# Altium schematic sheet Basic_Gates.SchDoc
size 111 x 66 mm
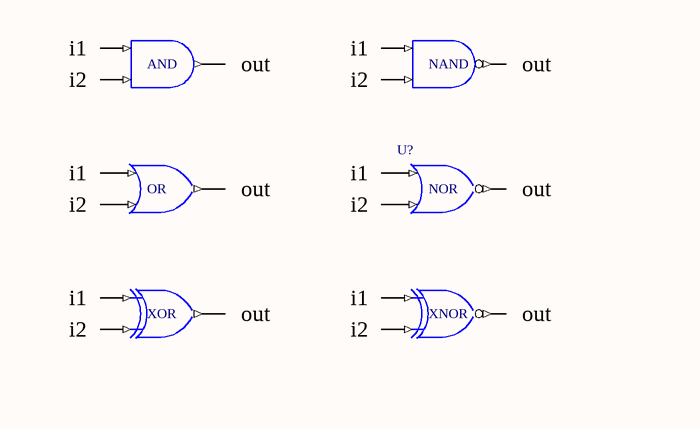
[diagram p0: Basic_Gates.SchDoc]

## Parts
(Parts that share a designator on the sheet are numbered #1, #2 ... from top to bottom, then left to right.)
U?#1  AND
U?#2  NAND
U?#3  OR
U?#4  NOR
U?#5  XOR
U?#6  XNOR

## Nets
GND: U?#5.7(GND)
VDD: U?#5.14(VDD)

Not connected (* = marked no-connect by the designer): U?#1 A B Y; U?#2 A B Y; U?#3 A B Y; U?#4 A B Y; U?#5 1(A) 2(B) 3(Y); U?#6 1(A) 2(B) 3(Y)

## Notes on the sheet
- (near U?#1) i1
- (near U?#1) out
- (near U?#2) i1
- (near U?#2) out
- (near U?#1) i2
- (near U?#2) i2
- (near U?#3) i1
- (near U?#3) i2
- (near U?#3) out
- (near U?#4) i1
- (near U?#4) i2
- (near U?#4) out
- (near U?#5) i1
- (near U?#6) i1
- (near U?#5) i2
- (near U?#5) out
- (near U?#6) i2
- (near U?#6) out

## Library data of the parts
U?#1 U?#2 = AND: 2 Input AND
U?#3 U?#4 = OR: 2 Input OR
U?#6 = XOR